# EAGLE design autism_ray_xaio (EAGLE 9.6.2)
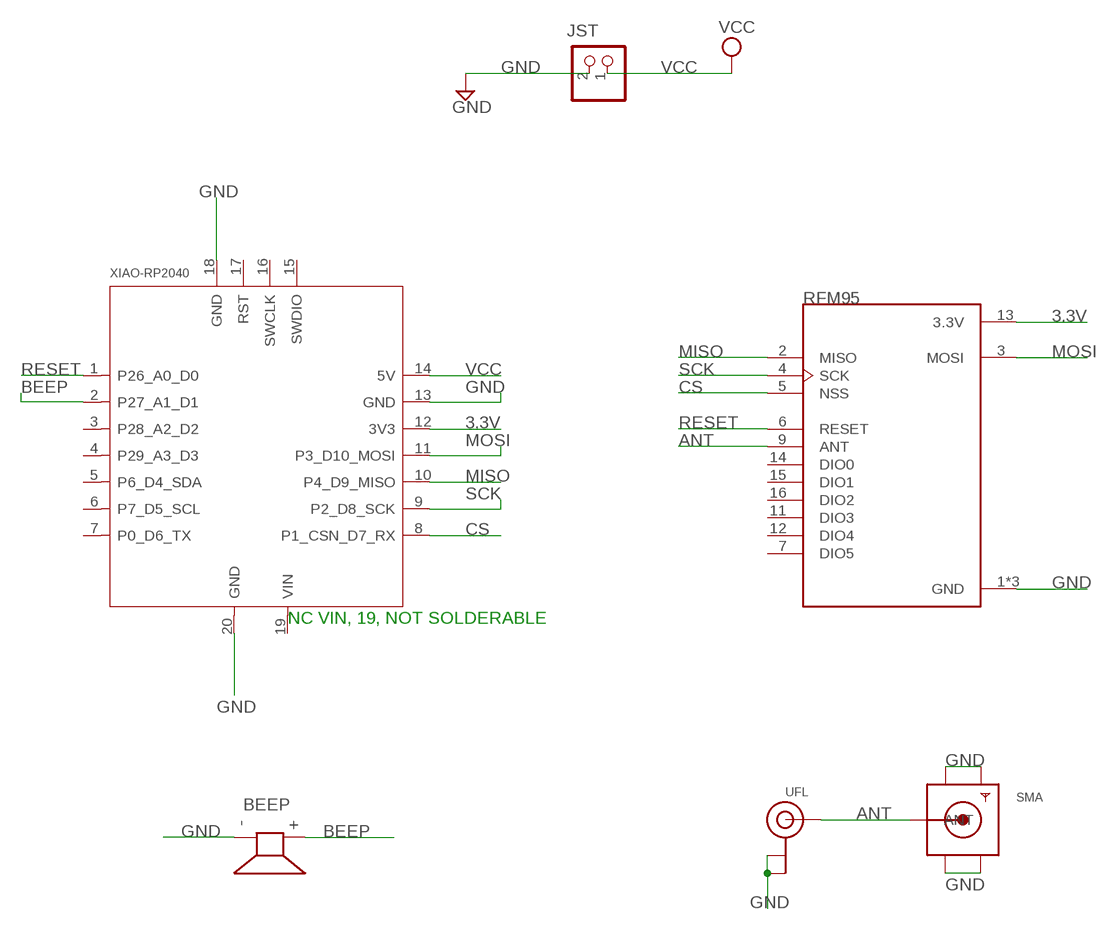
[diagram p0: schematic, sheet 1]

## Parts
BEEP  AI-1223-TWT-12V-R  [XDCR_AI-1223-TWT-12V-R]
JST  JST_2PIN-SMT-RA  [JST-PH-2-SMT-RA]
RFM95  RFM95W-915S2  [XCVR_RFM95W-915S2]
SMA  SMACONNECTOR_EDGE  [SMA_EDGELAUNCH]
UFL  ANTENNA_U.FL  [U.FL]
XIAO-RP2040  XIAO-RP2040  [XIAO-SAMD21/RP2040-MODULE14P-2.54-21X17.8MM]

## Nets
3.3V: RFM95.13(3.3V) XIAO-RP2040.12(3V3)
ANT: RFM95.9(ANT) SMA.P(ANT) UFL.3(SIGNAL)
BEEP: BEEP.P(+) XIAO-RP2040.2(P27_A1_D1)
CS: RFM95.5(NSS) XIAO-RP2040.8(P1_CSN_D7_RX)
GND: BEEP.N(-) JST.2 RFM95.1(GND) RFM95.8(GND) RFM95.10(GND) SMA.GND@1(GND4) SMA.GND@2(GND3) SMA.GND@3(GND2) SMA.GND@4(GND1) UFL.1(GND) UFL.2(GND) XIAO-RP2040.13(GND) XIAO-RP2040.18(GND) XIAO-RP2040.20(GND)
MISO: RFM95.2(MISO) XIAO-RP2040.10(P4_D9_MISO)
MOSI: RFM95.3(MOSI) XIAO-RP2040.11(P3_D10_MOSI)
RESET: RFM95.6(RESET) XIAO-RP2040.1(P26_A0_D0)
SCK: RFM95.4(SCK) XIAO-RP2040.9(P2_D8_SCK)
VCC: JST.1 XIAO-RP2040.14(5V)
Unconnected: RFM95.7(DIO5) RFM95.11(DIO3) RFM95.12(DIO4) RFM95.14(DIO0) RFM95.15(DIO1) RFM95.16(DIO2) XIAO-RP2040.3(P28_A2_D2) XIAO-RP2040.4(P29_A3_D3) XIAO-RP2040.5(P6_D4_SDA) XIAO-RP2040.6(P7_D5_SCL) XIAO-RP2040.7(P0_D6_TX) XIAO-RP2040.15(SWDIO) XIAO-RP2040.16(SWCLK) XIAO-RP2040.17(RST) XIAO-RP2040.19(VIN)

## Notes on the sheet
- NC VIN, 19, NOT SOLDERABLE

## Library data of the parts
BEEP = buzzer:AI-1223-TWT-12V-R: Check availability <https://pricing.snapeda.com/parts/AI-1223-TWT-12V-R/PUI%20Audio%2C/view-part?ref=eda>; AVAILABILITY: In Stock; DESCRIPTION: ELECTRO-MECHANICAL AUDIO INDICATOR; MF: PUI Audio,; MP: AI-1223-TWT-12V-R; PACKAGE: None; PRICE: None; PURCHASE-URL: https://pricing.snapeda.com/search/part/AI-1223-TWT-12V-R/?ref=eda
JST = adafruit:JST_2PIN: JST 2-Pin Connectors of various flavors SMT-RA (S2B-PH-SM4) 4UConnector #17311 SMT (B2B-PH-SM4) THM-RA (S2B-PH) THM (B2B-PH)
RFM95 = RFM95W-915S2:RFM95W-915S2: RFM95(W) - Low Power Long Range Transceiver Module V1.0 Check availability <https://pricing.snapeda.com/parts/RFM95W-915S2/RF%20Solutions/view-part?ref=eda>; AVAILABILITY: In Stock; DESCRIPTION: 802.15.4 LoRa™ Transceiver Module 915MHz Antenna Not Included Surface Mount; MF: RF Solutions; MP: RFM95W-915S2; PACKAGE: Non Standard RF Solutions; PRICE: None; PURCHASE-URL: https://pricing.snapeda.com/search/part/RFM95W-915S2/?ref=eda
SMA = adafruit:SMACONNECTOR: SMA Connector 90° DIP SMA Connector, 50 Ohm (4UConnector: 07259)
UFL = adafruit:ANTENNA_U.FL: U.FL Antenna Connector
XIAO-RP2040 = Seeed Studio XIAO Series:XIAO-RP2040: Seeed Studio XIAO RP2040 v1.22 - Raspberry Pi RP2040 Microcontroller - 32-bit 133MHz Dual-Core ARM® Cortex® M0+processor Seeed SKU: 102010428 Seeed Studio XIAO RP2040 is a microcontroller using the Raspberry Pi RP2040 chip. The MCU runs at up to 133MHz. It is built with rich interfaces in a tiny thumb size and fully supports Arduino, MicroPython, and CircuitPython. The onboard interfaces are enough for developing multiple applications. Buy now <https://www.seeedstudio.com/XIAO-RP2040-v1-0-p-5026.html> Wiki <https://wiki.seeedstudio.com/XIAO-RP2040/>

## Board
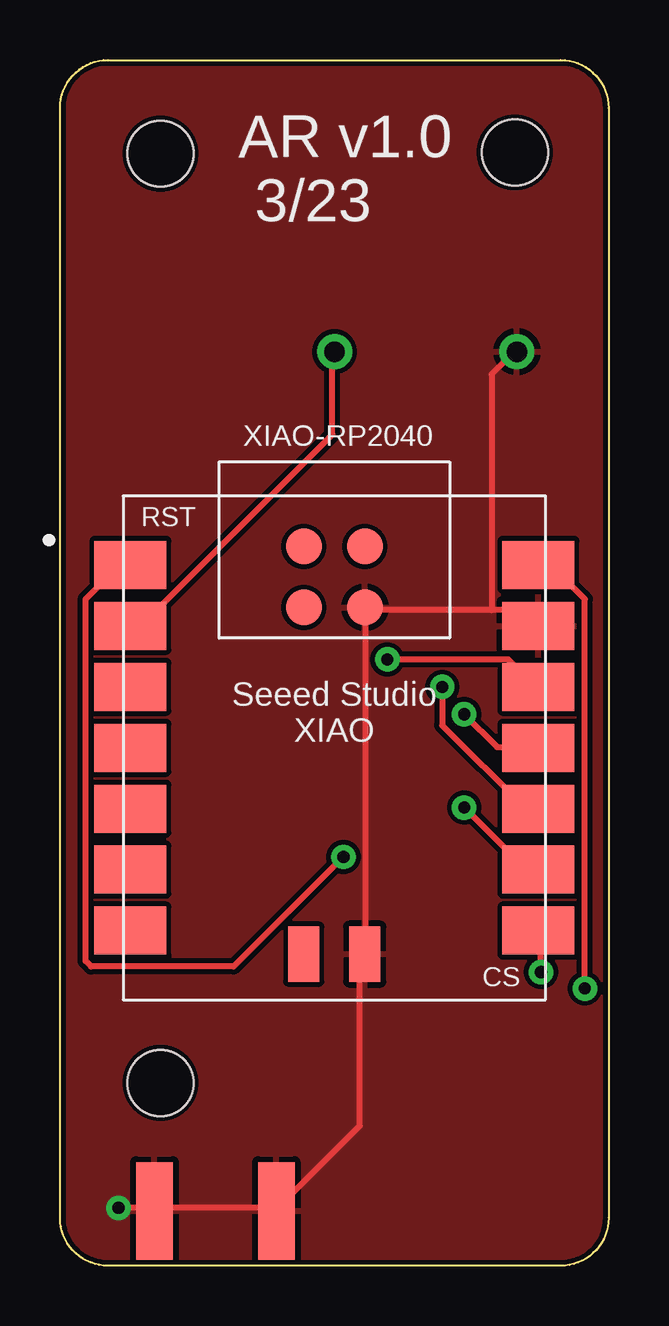
[diagram p1: board, top side]
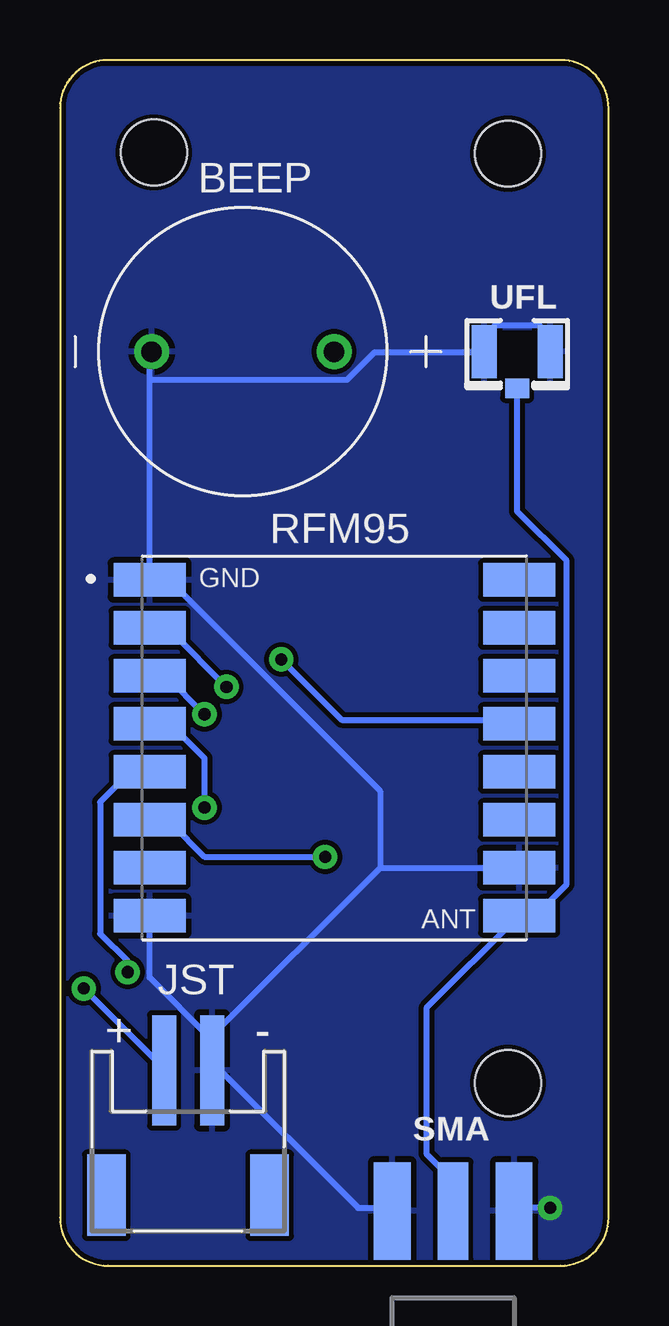
[diagram p2: board, bottom side, seen from below]

Size 22.86 x 50.26 mm. Coordinates in mm from the lower left corner, seen from the top.
Outline: 20.86,0 2,0 arc-90 0,2 0,48.26 arc-90 2,50.26 20.86,50.26 arc-90 22.86,48.26 22.86,2 arc-90 20.86,0
Copper layers (1*16): Top 0.035mm / dielectric 1.5mm / Bottom 0.035mm
Design rules "SparkFun_pico *": minimum track width 10mil, minimum drill 20mil, track to track 8mil, track to pad 8mil, pad to pad 8mil, via to via 8mil, smd to smd 8mil, copper to edge 8mil, drill to drill 8mil, minimum pad ring 12mil, minimum via ring 10mil, stop-mask expansion 4mil, vias tented up to drill 20mil, thermal gap 10mil
Holes 2.75 mm at 18.95,46.41 4.19,46.35 4.19,7.62

### Footprints (pad centres in the part's own frame; a part is rotated, then mirrored left to right if it is on the bottom)
XDCR_AI-1223-TWT-12V-R = drill 0.85: N 0,-3.8; P 0,3.8
JST-PH-2-SMT-RA = smd 1 x 4.6: 1 1,-3.7; 2 -1,-3.7 | smd 1.6 x 3.4: NC1 -3.4,1.5; NC2 3.4,1.5
XCVR_RFM95W-915S2 = smd 3 x 1.4: 1 -7.7,7; 2 -7.7,5; 3 -7.7,3; 4 -7.7,1; 5 -7.7,-1; 6 -7.7,-3; 7 -7.7,-5; 8 -7.7,-7; 9 7.7,-7; 10 7.7,-5; 11 7.7,-3; 12 7.7,-1; 13 7.7,1; 14 7.7,3; 15 7.7,5; 16 7.7,7
SMA_EDGELAUNCH = smd 4.064 x 1.524: GND@1 2.032,-2.54; GND@2 2.032,2.54 | smd 4.064 x 1.524 bottom: GND@3 2.032,2.54; GND@4 2.032,-2.54 | smd 4.064 x 1.27: P 2.032,0
U.FL = smd 2.2 x 1.05: 1 0,1.375; 2 0,-1.375 | smd 0.8 x 1: 3 1.525,0
XIAO-SAMD21/RP2040-MODULE14P-2.54-21X17.8MM = smd 3 x 2: 1 -8.5,7.62; 2 -8.5,5.08; 3 -8.5,2.54; 4 -8.5,0; 5 -8.5,-2.54; 6 -8.5,-5.08; 7 -8.5,-7.62; 8 8.5,-7.62; 9 8.5,-5.08; 10 8.5,-2.54; 11 8.5,0; 12 8.5,2.54; 13 8.5,5.08; 14 8.5,7.62 | smd 1.5 x 1.5: 15 -1.27,8.39; 16 1.27,8.39; 17 -1.27,5.85; 18 1.27,5.85 | smd 1.3 x 2.3: 19 -1.27,-8.6; 20 1.27,-8.6

### Placement (x,y rotation side)
BEEP  15.24,38.1 270 bottom
JST  17.53,4.44 180 bottom
RFM95  11.43,21.59 0 bottom
SMA  6.48,0.25 90 bottom
UFL  3.81,38.1 270 bottom
XIAO-RP2040  11.43,21.59 0 top

### Tracks (layer width: path | path; a pad name or v marks a point on that pad's centre or on a via)
3.3V  (via drill 0.51)
  Top 0.254: v13.64,25.27 18.67,25.27 19.81,24.13 XIAO-RP2040.12
  Bottom 0.254: v13.64,25.27 11.12,22.76 3.81,22.76 RFM95.13
ANT
  Bottom 0.254: UFL.3 3.81,31.44 1.75,29.39 1.75,15.9 2.9,14.76 3.58,14.76 RFM95.9 3.81,14.53 7.59,10.74 7.59,4.67 6.48,3.56 SMA.P
BEEP
  Top 0.254: BEEP.P 11.35,38.08 11.35,34.65 3.58,26.87 3.12,26.87 XIAO-RP2040.2
CS  (via drill 0.51)
  Top 0.254: v20.04,12.24 20.04,13.84 XIAO-RP2040.8
  Bottom 0.254: v20.04,12.24 20.04,12.7 21.18,13.84 21.18,19.33 20.04,20.47 19.36,20.47 RFM95.5
GND  (via drill 0.51)
  Top 0.254: v2.44,2.41 3.81,2.41 SMA.GND@1 4.04,2.41 8.84,2.41 SMA.GND@2 9.07,2.41 12.5,5.84 12.5,12.93 XIAO-RP2040.20 12.72,13.16 12.72,27.33 | 17.98,27.33 19.36,27.33 19.81,26.87 XIAO-RP2040.13 | 17.98,27.33 12.72,27.33 | 17.98,27.33 17.98,37.16 18.9,38.08 BEEP.N | 12.72,27.33 XIAO-RP2040.18
  Bottom 0.254: 16.61,9.5 19.13,12.01 19.13,14.53 RFM95.8 | 16.61,9.5 16.61,8.36 JST.2 | 9.52,16.59 3.81,16.59 RFM95.10 | 16.61,9.5 9.52,16.59 | 16.61,9.5 JST.2 | SMA.GND@2 9.07,2.41 10.44,2.41 16.38,8.36 JST.2 | v2.44,2.41 3.81,2.41 SMA.GND@1 | UFL.1 2.44,38.3 2.44,38.76 2.9,39.22 4.72,39.22 5.18,38.76 5.18,38.3 UFL.2 5.41,38.08 9.75,38.08 10.9,36.93 19.13,36.93 | 19.13,36.93 19.13,28.7 RFM95.1 19.13,28.47 18.21,28.47 9.52,19.79 9.52,16.59 | 19.13,36.93 19.13,38.08 BEEP.N
  pour Top: -2.35,49.88 -2.35,-9.81 30.67,-9.81 30.67,57.5 -2.35,57.5
  pour Bottom: 23.05,-9.81 -3.62,-9.81 -3.62,53.69 24.32,53.69 24.32,-9.81
MISO  (via drill 0.51)
  Top 0.254: v15.93,24.13 15.93,22.53 19.36,19.1 19.81,19.1 XIAO-RP2040.10
  Bottom 0.254: v15.93,24.13 18.21,26.42 19.13,26.42 RFM95.2
MOSI  (via drill 0.51)
  Top 0.254: v16.84,22.99 18.21,21.61 19.81,21.61 XIAO-RP2040.11
  Bottom 0.254: v16.84,22.99 18.44,24.59 RFM95.3
RESET  (via drill 0.51)
  Top 0.254: v11.81,17.04 7.24,12.47 1.29,12.47 1.07,12.7 1.07,27.79 2.44,29.16 2.9,29.16 XIAO-RP2040.1
  Bottom 0.254: v11.81,17.04 16.84,17.04 18.21,18.42 19.13,18.42 RFM95.6
SCK  (via drill 0.51)
  Top 0.254: v16.84,19.1 19.36,16.59 19.81,16.59 XIAO-RP2040.9
  Bottom 0.254: v16.84,19.1 16.84,21.16 18.21,22.53 19.13,22.53 RFM95.4
VCC  (via drill 0.51)
  Top 0.254: v21.87,11.56 21.87,27.79 20.5,29.16 20.04,29.16 XIAO-RP2040.14
  Bottom 0.254: v21.87,11.56 18.67,8.36 JST.1

### Text on the board
tPlace: AR v1.0 / 3/23 | RST | CS
bPlace: GND | ANT